# Altium schematic sheet Cover.SchDoc
size 420 x 297 mm; SheetNumber: 1; SheetTotal: 5
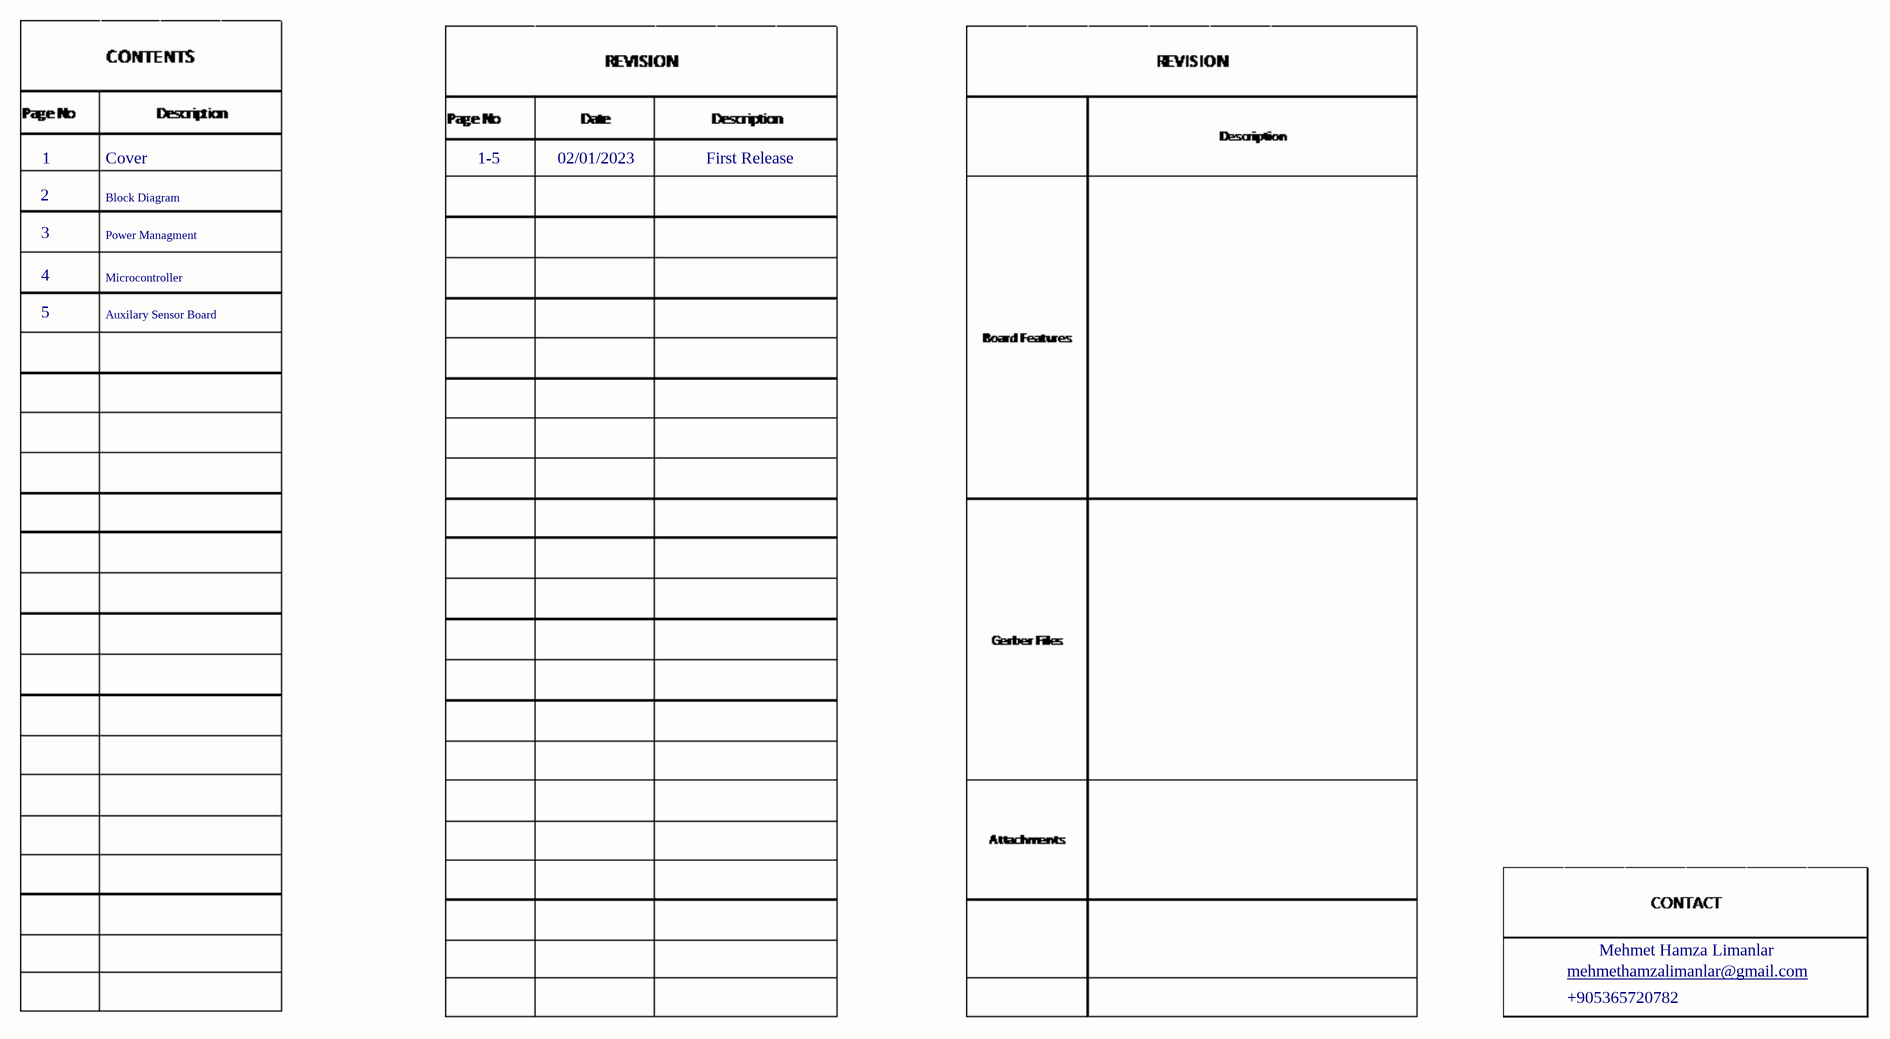
[diagram p0: Cover.SchDoc]

## Notes on the sheet
- 2
- 1
- Cover
- Block Diagram
- 1-5
- 02/01/2023
- First Release
- 3
- 4
- Power Managment
- Microcontroller
- 5
- Auxilary Sensor Board
- Mehmet Hamza Limanlar
- mehmethamzalimanlar@gmail.com
- +905365720782
- PROJECT:
- DRAWN BY:
- Engineer: M.Hamza Limanlar
- REVISION:
- FILE NAME:
- Starting Date:
- Release Date:
- SCALE:
- A3
- SIZE
- Department:
- R&D
- Checked / Approved BY:
- DESCRIPTION:
- SHEET
- OF